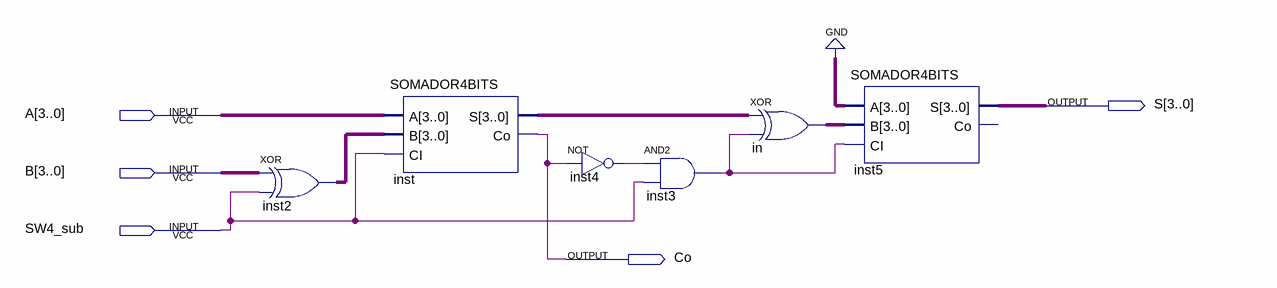
[diagram p0: schematic sheet]
// Quartus schematic SOMA_SUB-4BITS.bdf as structural Verilog: 6 symbols, 5 pins
module \SOMA_SUB-4BITS  (
  input  [3:0] A,
  input  [3:0] B,
  input  SW4_sub,
  output [3:0] S,
  output Co
);

  wire inst3_out, inst4_out;
  wire [3:0] in_out, inst2_out, inst_s;

  assign inst2_out = B ^ {4{SW4_sub}};  // XOR inst2, 4 bits wide
  SOMADOR4BITS inst (.A(A), .B(inst2_out), .CI(SW4_sub), .S(inst_s), .Co(Co));
  not inst4 (inst4_out, Co);
  and inst3 (inst3_out, inst4_out, SW4_sub);
  assign in_out = inst_s ^ {4{inst3_out}};  // XOR in, 4 bits wide
  SOMADOR4BITS inst5 (.A(4'b0000), .B(in_out), .CI(inst3_out), .S(S));  // open: Co
endmodule
